# Altium schematic sheet Sheet_Course_Mitr — копия.SchDoc: Устройство дистанционного управления с помощью телефона
size 420 x 297 mm; CheckedBy: Соболева Н.С.; Author: Митр Д. В.; Address1: Address1; Address2: Address2; Address3: Address3; Address4: Address4; DocumentNumber: АБВГ.000012.001 Э3; SheetTotal: 1; DocumentType: Схема электрическая принципиальная; DevelopedBy: Митр Д.В.
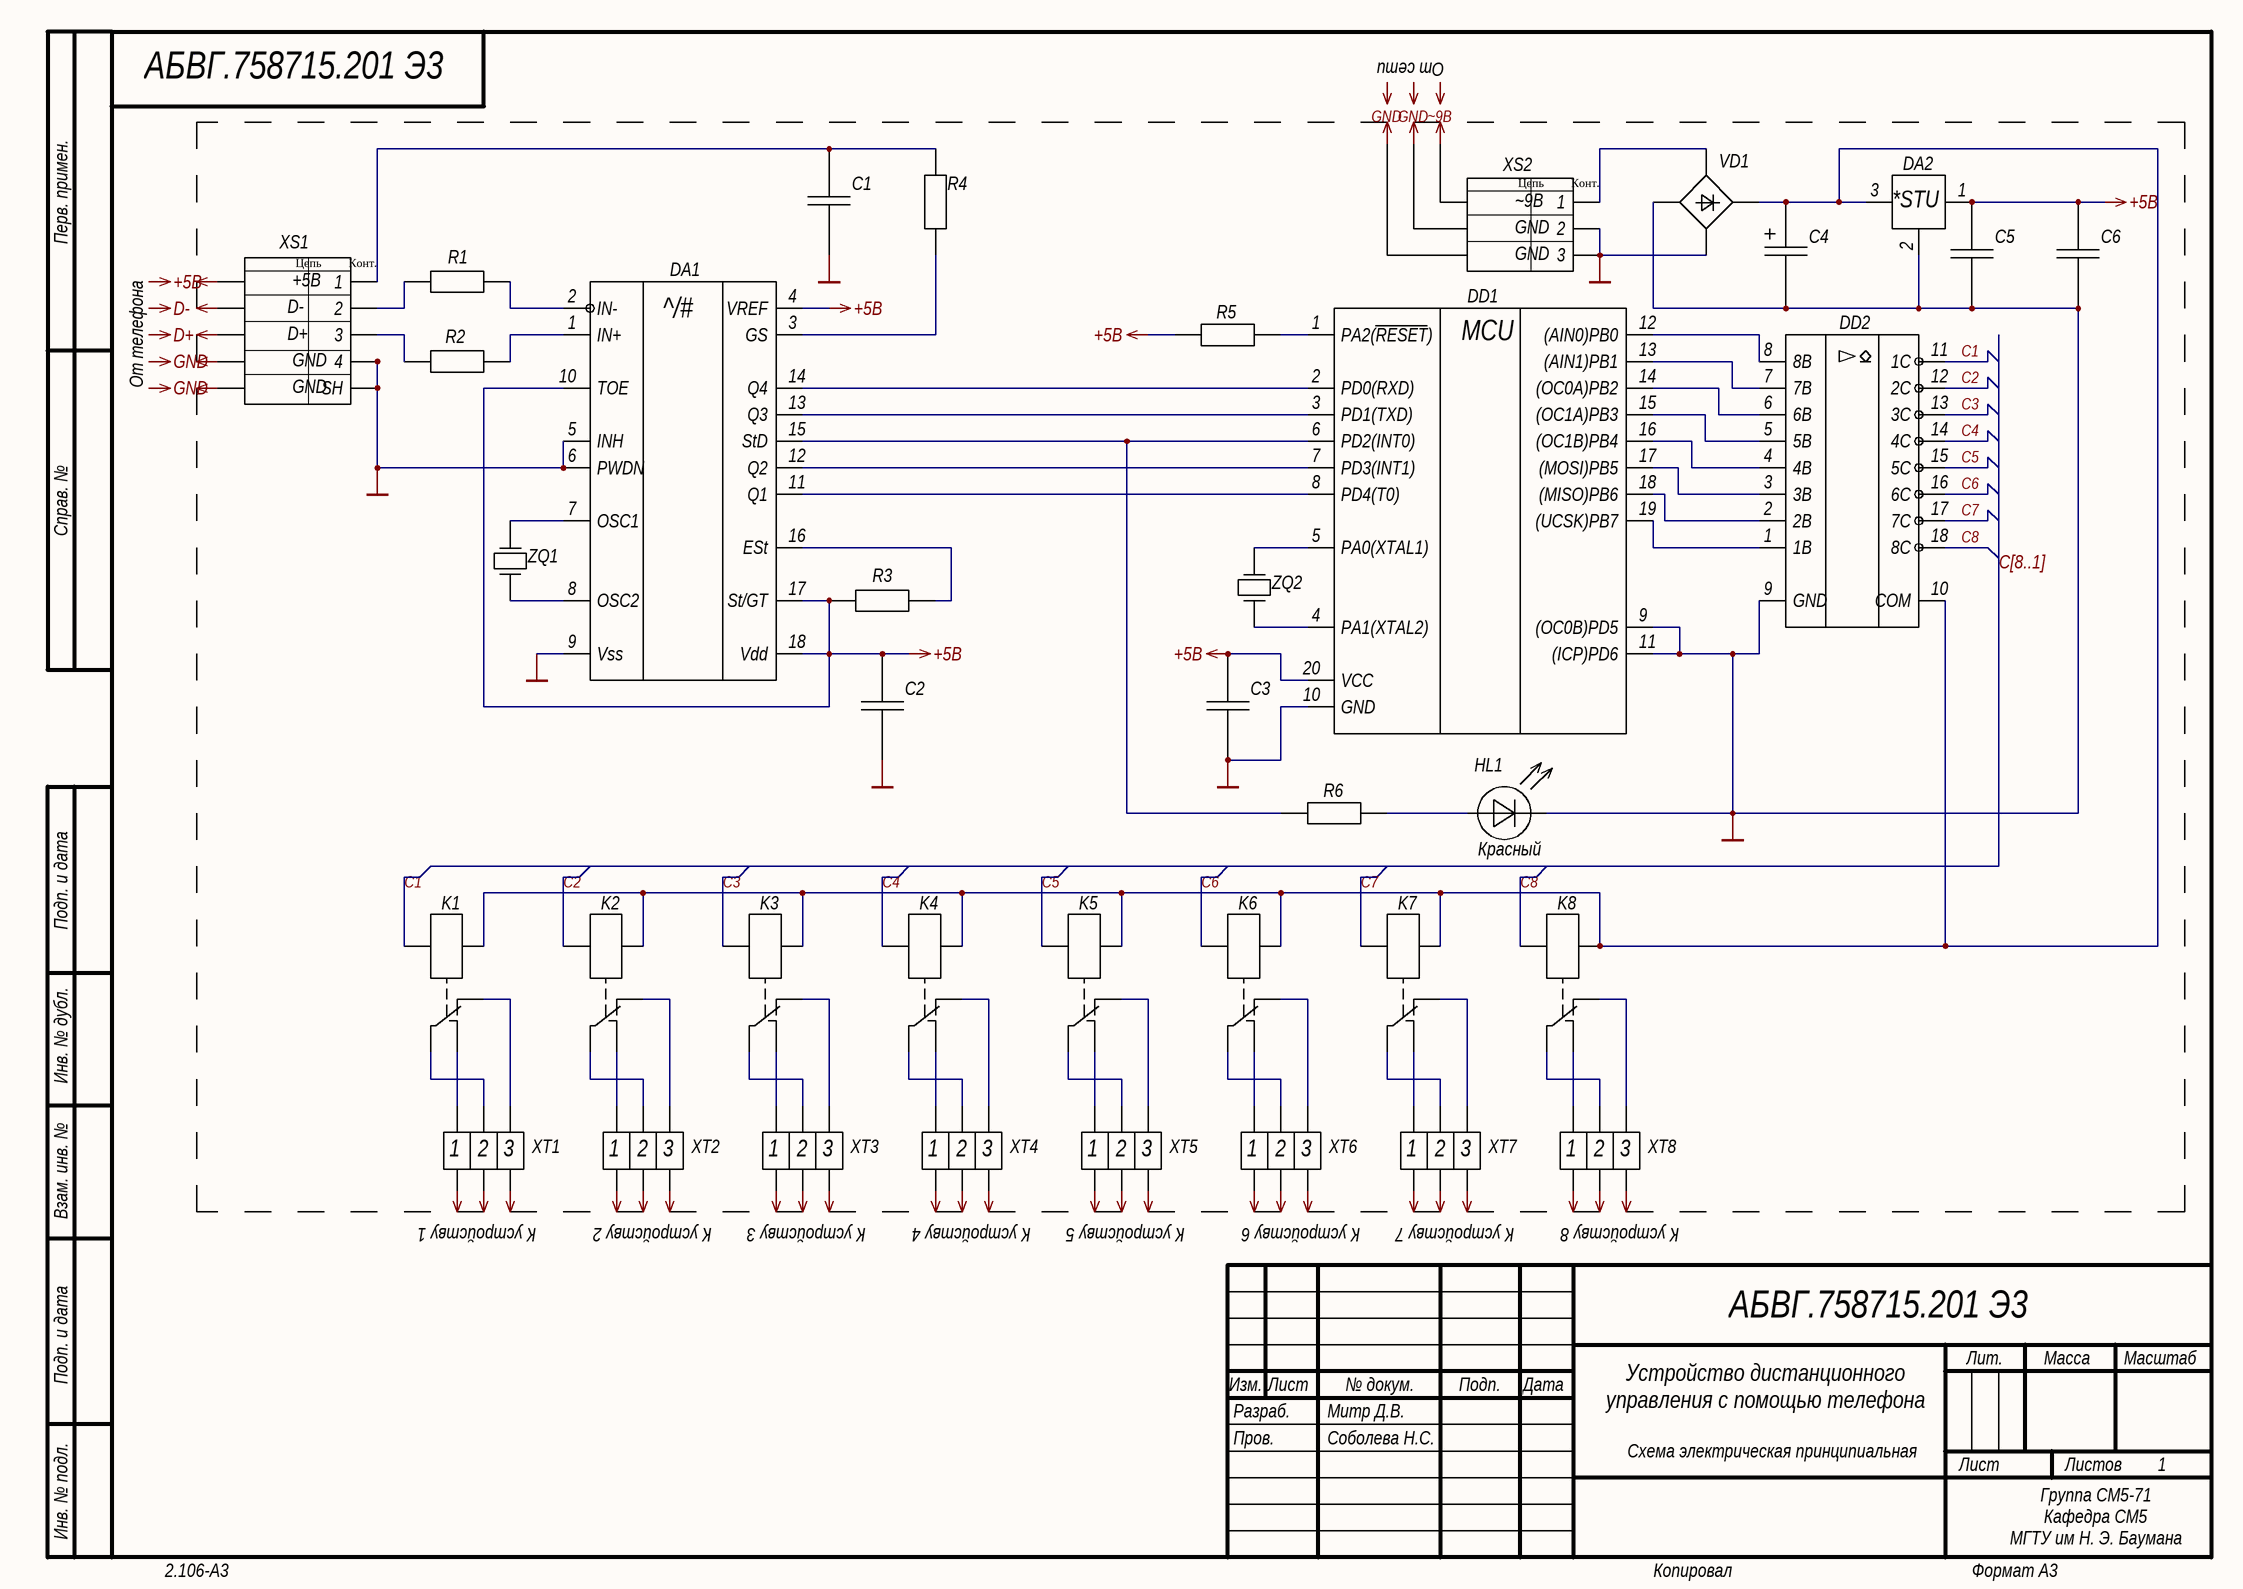
[diagram p0: Sheet_Course_Mitr — копия.SchDoc]

## Parts
C1  0,1 мкФ  [0805_CAP]  (value not drawn)
C2  0,1 мкФ  [0805_CAP]  (value not drawn)
C3  0,1 мкФ  [0805_CAP]  (value not drawn)
C4  2200 мкФ  [Pol_CAP]  (value not drawn)
C5  0,1 мкФ  [0805_CAP]  (value not drawn)
C6  0,1 мкФ  [0805_CAP]  (value not drawn)
DA1  MT8870DS  [CM8870C-SOP18]  (value not drawn)
DA2  78L05  [STU]  (value not drawn)
DD1  ATtiny2313  [ATtiny2313-SOP20]  (value not drawn)
DD2  ULN2803A  [ULN2803-SOP18]  (value not drawn)
HL1  Красный  [Blink_RED]
K1  LEG-12  [LEG-12]  (value not drawn)
K2  LEG-12  [LEG-12]  (value not drawn)
K3  LEG-12  [LEG-12]  (value not drawn)
K4  LEG-12  [LEG-12]  (value not drawn)
K5  LEG-12  [LEG-12]  (value not drawn)
K6  LEG-12  [LEG-12]  (value not drawn)
K7  LEG-12  [LEG-12]  (value not drawn)
K8  LEG-12  [LEG-12]  (value not drawn)
R1  100 кОм  [0805_RES]  (value not drawn)
R2  100 кОм  [0805_RES]  (value not drawn)
R3  300 кОм  [0805_RES]  (value not drawn)
R4  100 кОм  [0805_RES]  (value not drawn)
R5  10 кОм  [0805_RES]  (value not drawn)
R6  1 кОм  [0805_RES]  (value not drawn)
VD1  DF04S  [Diode_Bridge]  (value not drawn)
XS1  USB_TypeB  [USB-B TE Connectivity 292304-1]  (value not drawn)
XS2  DJK-02B  [DJK-02B]  (value not drawn)
XT1  KLS2  [pad]  (value not drawn)
XT2  KLS2  [pad]  (value not drawn)
XT3  KLS2  [pad]  (value not drawn)
XT4  KLS2  [pad]  (value not drawn)
XT5  KLS2  [pad]  (value not drawn)
XT6  KLS2  [pad]  (value not drawn)
XT7  KLS2  [pad]  (value not drawn)
XT8  KLS2  [pad]  (value not drawn)
ZQ1  (no value)  [Quartz]
ZQ2  (no value)  [Quartz]

## Nets
+5В: C2.2 C3.2 C5.2 C6.2 DA1.4(VREF) DA1.10(TOE) DA1.17(St/GT) DA1.18(Vdd) DA2.1 DD1.20(VCC) R3.1 R5.2
GND: C1.1 C2.1 C3.1 C4.2 C5.1 C6.1 DA1.5(INH) DA1.6(PWDN) DA1.9(Vss) DA2.2 DD1.9((OC0B)PD5) DD1.10(GND) DD1.11((ICP)PD6) DD2.9(GND) HL1.K VD1.1 VD1.4 XS1.0(SH) XS1.4 XS2.2 XS2.3
C1: DD2.11(1С) K1.5
C2: C4.1 DA2.3 DD2.10(COM) DD2.12(2С) DD2.13(3С) DD2.14(4C) DD2.15(5С) DD2.16(6С) DD2.17(7С) DD2.18(8С) K1.4 K2.4 K2.5 K3.4 K3.5 K4.4 K4.5 K5.4 K5.5 K6.4 K6.5 K7.4 K7.5 K8.4 K8.5 VD1.2  [also labelled C3, C4, C5, C6, C7, C8]
NetC1_2: C1.2 R4.1 XS1.1
NetDA1_1: DA1.1(IN+) R2.1
NetDA1_2: DA1.2(IN-) R1.1
NetDA1_3: DA1.3(GS) R4.2
NetDA1_7: DA1.7(OSC1) ZQ1.2
NetDA1_8: DA1.8(OSC2) ZQ1.1
NetDA1_11: DA1.11(Q1) DD1.8(PD4(T0))
NetDA1_12: DA1.12(Q2) DD1.7(PD3(INT1))
NetDA1_13: DA1.13(Q3) DD1.3(PD1(TXD))
NetDA1_14: DA1.14(Q4) DD1.2(PD0(RXD))
NetDA1_15: DA1.15(StD) DD1.6(PD2(INT0)) R6.2
NetDA1_16: DA1.16(ESt) R3.2
NetDD1_1: DD1.1(PA2(~{RESET})) R5.1
NetDD1_4: DD1.4(PA1(XTAL2)) ZQ2.1
NetDD1_5: DD1.5(PA0(XTAL1)) ZQ2.2
NetDD1_12: DD1.12((AIN0)PB0) DD2.8(8В)
NetDD1_13: DD1.13((AIN1)PB1) DD2.7(7В)
NetDD1_14: DD1.14((OC0A)PB2) DD2.6(6В)
NetDD1_15: DD1.15((OC1A)PB3) DD2.5(5В)
NetDD1_16: DD1.16((OC1B)PB4) DD2.4(4В)
NetDD1_17: DD1.17((MOSI)PB5) DD2.3(3В)
NetDD1_18: DD1.18((MISO)PB6) DD2.2(2В)
NetDD1_19: DD1.19((UCSK)PB7) DD2.1(1В)
NetHL1_A: HL1.A R6.1
NetK1_1: K1.1 XT1.1
NetK1_2: K1.2 XT1.2
NetK1_3: K1.3 XT1.3
NetK2_1: K2.1 XT2.1
NetK2_2: K2.2 XT2.2
NetK2_3: K2.3 XT2.3
NetK3_1: K3.1 XT3.1
NetK3_2: K3.2 XT3.2
NetK3_3: K3.3 XT3.3
NetK4_1: K4.1 XT4.1
NetK4_2: K4.2 XT4.2
NetK4_3: K4.3 XT4.3
NetK5_1: K5.1 XT5.1
NetK5_2: K5.2 XT5.2
NetK5_3: K5.3 XT5.3
NetK6_1: K6.1 XT6.1
NetK6_2: K6.2 XT6.2
NetK6_3: K6.3 XT6.3
NetK7_1: K7.1 XT7.1
NetK7_2: K7.2 XT7.2
NetK7_3: K7.3 XT7.3
NetK8_1: K8.1 XT8.1
NetK8_2: K8.2 XT8.2
NetK8_3: K8.3 XT8.3
NetR1_2: R1.2 XS1.2
NetR2_2: R2.2 XS1.3
NetVD1_3: VD1.3 XS2.1

## Buses and harness runs
bus C[8..1]

## Notes on the sheet
- От сети
- От телефона
- К устройству 1
- К устройству 2
- К устройству 3
- К устройству 4
- К устройству 5
- К устройству 6
- К устройству 7
- К устройству 8
- Labels drawn without touching a wire or pin: +5В, D+, D-, GND, ~9В
- АБВГ.758715.201 Э3
- Перв. примен.
- Справ. №
- Подп. и дата
- Инв. № дубл.
- Взам. инв. №
- Разраб.
- Изм.
- Лист
- Митр Д.В.
- № докум.
- Подп.
- Дата
- Лит.
- Масса
- Масштаб
- Пров.
- Соболева Н.С.
- Устройство дистанционного управления с помощью телефона
- Схема электрическая принципиальная
- Листов
- 1
- Инв. № подл.
- 2.106-A3
- Копировал
- Формат А3
- Группа СМ5-71
  Кафедра СМ5
  МГТУ им Н. Э. Баумана
- (in symbol ATtiny2313) MCU
- (in symbol DJK-02B_PWR_CON) Цепь; Конт.; ~9В; GND
- (in symbol MT8870DS) ^/#
- (in symbol STU) *STU
- (in symbol USB_TypeB) Цепь; Конт.; +5В; D-; D+; GND

## Library data of the parts
C1-C3 C5 C6 = Capacitor: ValueType: Конденсатор; Value: 0,1 мкФ; Tolerance: *; Dielectric: *; Voltage: *; ESR: *; URL: *; Temp: *; Power: *; Case: *; ValueManufacturer: *; ValueManufacturerPartNumber: *; ValueDescription: *
C4 = Capacitor_pol: ValueType: Конденсатор; Value: 2200 мкФ; Tolerance: *; Dielectric: *; Voltage: *; ESR: *; URL: *; Temp: *; Power: *; Case: *; ValueManufacturer: *; ValueManufacturerPartNumber: *; ValueDescription: *
DA2 = STU
DD1 = ATtiny2313: ValueManufacture: ATMEGA; ValueDescription: Микроконтроллер; Case: soic-20(0.295 inch); ValueType: Микроконтроллер; ValueManufacturePartNumber: ATtiny2313
HL1 = Led_red: ValueManufacturer: Foryard; ValueManufacturerPartNumber: fyls-0603urc; Temp: -55...+150; ValueType: Светодиод; Value: Красный; URL: *; Case: 0603; ValueDescription: Светодиод
K1-K8 = Relay
R1-R6 = Resistor: ValueType: Резистор; Tolerance: *; URL: *; Temp: *; Power: *; Case: *; ValueManufacturerPartNumber: *; ValueDescription: *
  R1 R2 R4: Value: 100 кОм
  R3: Value: 300 кОм
  R5: Value: 10 кОм
  R6: Value: 1 кОм
VD1 = Diode_bridge: Manufacture: Диодный Мост; PartNumber: DF04S; Case: SDIP
XS1 = USB_TypeB: ValueManufacturer: Te Connectivity; ValueManufacturerPartNumber: 292304-1; ValueType: USB разъем тип B; Value: *; URL: *
XS2 = DJK-02B_PWR_CON: ValueManufacturer: KLS; ValueType: Разъем питания; URL: *; TEMP: *; Case: *; ValueManufacturerPartNumber: DJK-02B; ValueDescription: DJK-02B
XT1-XT8 = pad
ZQ1 ZQ2 = Quartz: ValueType: Кварцевый резонатор; ValueManufacturer: *; ValueManufacturerPartNumber: *; ValueDescription: *